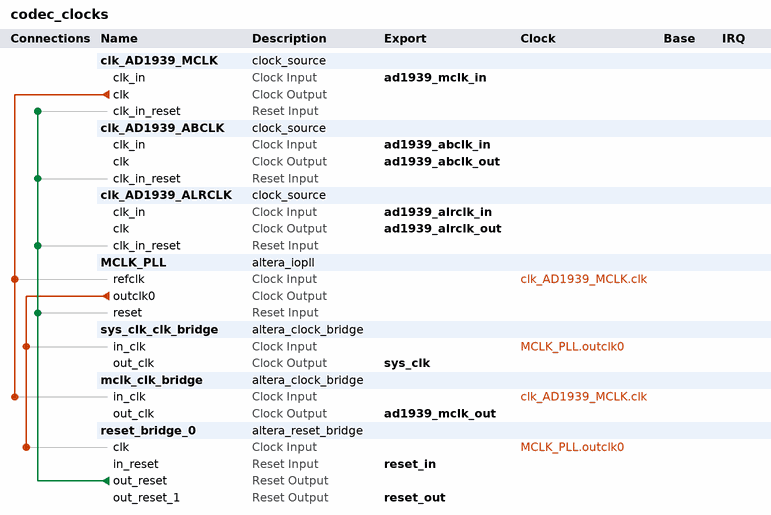
[diagram p0: system contents]
# Platform Designer (Qsys) system codec_clocks, Arria 10 10AS066H2F34I1SG
# Parameters at their usual value, and those the tool derives, are not listed.
package require -exact qsys 18.0
create_system codec_clocks
set_project_property DEVICE_FAMILY {Arria 10}
set_project_property DEVICE 10AS066H2F34I1SG

add_instance clk_AD1939_MCLK clock_source 18.0
set_instance_parameter_value clk_AD1939_MCLK clockFrequency 12288000

add_instance clk_AD1939_ABCLK clock_source 18.0
set_instance_parameter_value clk_AD1939_ABCLK clockFrequency 12288000

add_instance clk_AD1939_ALRCLK clock_source 18.0
set_instance_parameter_value clk_AD1939_ALRCLK clockFrequency 192000

add_instance MCLK_PLL altera_iopll 18.0
set_instance_parameter_value MCLK_PLL gui_c_cnt_in_src0 c_m_cnt_in_src_ph_mux_clk
set_instance_parameter_value MCLK_PLL gui_cal_code_hex_file iossm.hex
set_instance_parameter_value MCLK_PLL gui_cal_converge false
set_instance_parameter_value MCLK_PLL gui_cal_error cal_clean
set_instance_parameter_value MCLK_PLL gui_clock_name_global false
set_instance_parameter_value MCLK_PLL gui_clock_name_string0 sys_clk
set_instance_parameter_value MCLK_PLL gui_clock_to_compensate 0
set_instance_parameter_value MCLK_PLL gui_debug_mode false
set_instance_parameter_value MCLK_PLL gui_en_lvds_ports Disabled
set_instance_parameter_value MCLK_PLL gui_existing_mif_file_path {~/pll.mif}
set_instance_parameter_value MCLK_PLL gui_include_iossm false
set_instance_parameter_value MCLK_PLL gui_lock_setting {Low Lock Time}
set_instance_parameter_value MCLK_PLL gui_mif_config_name unnamed
set_instance_parameter_value MCLK_PLL gui_mif_gen_options {Generate New MIF File}
set_instance_parameter_value MCLK_PLL gui_new_mif_file_path {~/pll.mif}
set_instance_parameter_value MCLK_PLL gui_number_of_clocks 1
set_instance_parameter_value MCLK_PLL gui_operation_mode direct
set_instance_parameter_value MCLK_PLL gui_output_clock_frequency0 98.304
set_instance_parameter_value MCLK_PLL gui_parameter_table_hex_file seq_params_sim.hex
set_instance_parameter_value MCLK_PLL gui_pll_cal_done false
set_instance_parameter_value MCLK_PLL gui_pll_freqcal_en true
set_instance_parameter_value MCLK_PLL gui_pll_freqcal_req_flag true
set_instance_parameter_value MCLK_PLL gui_pll_m_cnt_in_src c_m_cnt_in_src_ph_mux_clk
set_instance_parameter_value MCLK_PLL gui_pll_tclk_mux_en false
set_instance_parameter_value MCLK_PLL gui_pll_tclk_sel pll_tclk_m_src
set_instance_parameter_value MCLK_PLL gui_pll_type S10_Simple
set_instance_parameter_value MCLK_PLL gui_pll_vco_freq_band_0 pll_freq_clk0_disabled
set_instance_parameter_value MCLK_PLL gui_reference_clock_frequency 12.288
set_instance_parameter_value MCLK_PLL gui_use_NDFB_modes false
set_instance_parameter_value MCLK_PLL gui_use_locked false
set_instance_parameter_value MCLK_PLL gui_usr_device_speed_grade 1
set_instance_parameter_value MCLK_PLL gui_vco_frequency 600.0
set_instance_parameter_value MCLK_PLL hp_qsys_scripting_mode false
set_instance_parameter_value MCLK_PLL system_info_device_component 10AS066H2F34I1SG
set_instance_parameter_value MCLK_PLL system_info_device_speed_grade 1
set_instance_parameter_value MCLK_PLL system_part_trait_speed_grade 1

add_instance sys_clk_clk_bridge altera_clock_bridge 18.0
set_instance_parameter_value sys_clk_clk_bridge DERIVED_CLOCK_RATE 98304000
set_instance_parameter_value sys_clk_clk_bridge EXPLICIT_CLOCK_RATE 0

add_instance mclk_clk_bridge altera_clock_bridge 18.0
set_instance_parameter_value mclk_clk_bridge DERIVED_CLOCK_RATE 12288000
set_instance_parameter_value mclk_clk_bridge EXPLICIT_CLOCK_RATE 0

add_instance reset_bridge_0 altera_reset_bridge 18.0
set_instance_parameter_value reset_bridge_0 ACTIVE_LOW_RESET 0
set_instance_parameter_value reset_bridge_0 NUM_RESET_OUTPUTS 2
set_instance_parameter_value reset_bridge_0 SYNCHRONOUS_EDGES deassert

# connections
add_connection clk_AD1939_MCLK.clk mclk_clk_bridge.in_clk clock
add_connection clk_AD1939_MCLK.clk MCLK_PLL.refclk clock
add_connection MCLK_PLL.outclk0 reset_bridge_0.clk clock
add_connection MCLK_PLL.outclk0 sys_clk_clk_bridge.in_clk clock
add_connection reset_bridge_0.out_reset clk_AD1939_ABCLK.clk_in_reset reset
add_connection reset_bridge_0.out_reset clk_AD1939_ALRCLK.clk_in_reset reset
add_connection reset_bridge_0.out_reset clk_AD1939_MCLK.clk_in_reset reset
add_connection reset_bridge_0.out_reset MCLK_PLL.reset reset

# exported interfaces
add_interface ad1939_abclk_in clock sink
set_interface_property ad1939_abclk_in EXPORT_OF clk_AD1939_ABCLK.clk_in
add_interface ad1939_abclk_out clock source
set_interface_property ad1939_abclk_out EXPORT_OF clk_AD1939_ABCLK.clk
add_interface ad1939_alrclk_in clock sink
set_interface_property ad1939_alrclk_in EXPORT_OF clk_AD1939_ALRCLK.clk_in
add_interface ad1939_alrclk_out clock source
set_interface_property ad1939_alrclk_out EXPORT_OF clk_AD1939_ALRCLK.clk
add_interface ad1939_mclk_in clock sink
set_interface_property ad1939_mclk_in EXPORT_OF clk_AD1939_MCLK.clk_in
add_interface ad1939_mclk_out clock source
set_interface_property ad1939_mclk_out EXPORT_OF mclk_clk_bridge.out_clk
add_interface reset_in reset sink
set_interface_property reset_in EXPORT_OF reset_bridge_0.in_reset
add_interface reset_out reset source
set_interface_property reset_out EXPORT_OF reset_bridge_0.out_reset_1
add_interface sys_clk clock source
set_interface_property sys_clk EXPORT_OF sys_clk_clk_bridge.out_clk

set_interconnect_requirement {$system} qsys_mm.clockCrossingAdapter HANDSHAKE
set_interconnect_requirement {$system} qsys_mm.enableEccProtection FALSE
set_interconnect_requirement {$system} qsys_mm.insertDefaultSlave FALSE
set_interconnect_requirement {$system} qsys_mm.maxAdditionalLatency 1

save_system codec_clocks.qsys
